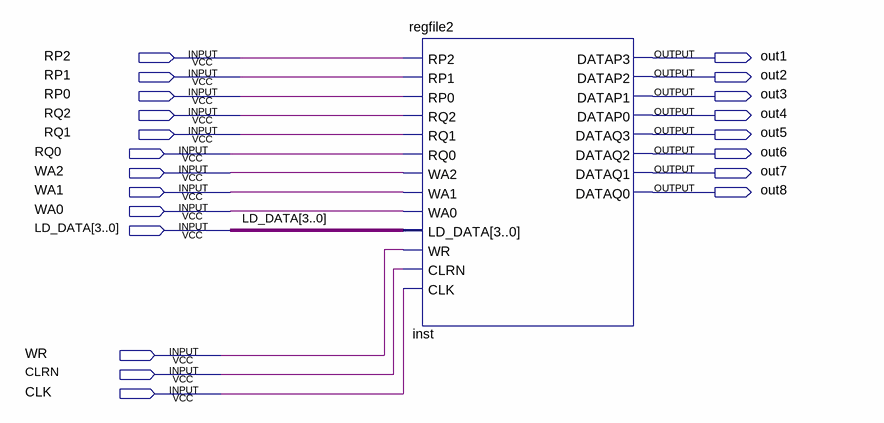
[diagram p0: schematic sheet]
// Quartus schematic q4.bdf as structural Verilog: 1 symbols, 21 pins
module q4 (
  input  RP2,
  input  RP1,
  input  RP0,
  input  RQ2,
  input  RQ1,
  input  RQ0,
  input  WA2,
  input  WA1,
  input  WA0,
  input  [3:0] LD_DATA,
  input  WR,
  input  CLRN,
  input  CLK,
  output out1,
  output out2,
  output out3,
  output out4,
  output out5,
  output out6,
  output out7,
  output out8
);

  regfile2 inst (
    .RP2(RP2), .RP1(RP1), .RP0(RP0), .RQ2(RQ2), .RQ1(RQ1), .RQ0(RQ0), .WA2(WA2), .WA1(WA1), .WA0(WA0),
    .LD_DATA(LD_DATA), .WR(WR), .CLRN(CLRN), .CLK(CLK), .DATAP3(out1), .DATAP2(out2), .DATAP1(out3),
    .DATAP0(out4), .DATAQ3(out5), .DATAQ2(out6), .DATAQ1(out7), .DATAQ0(out8));
endmodule
